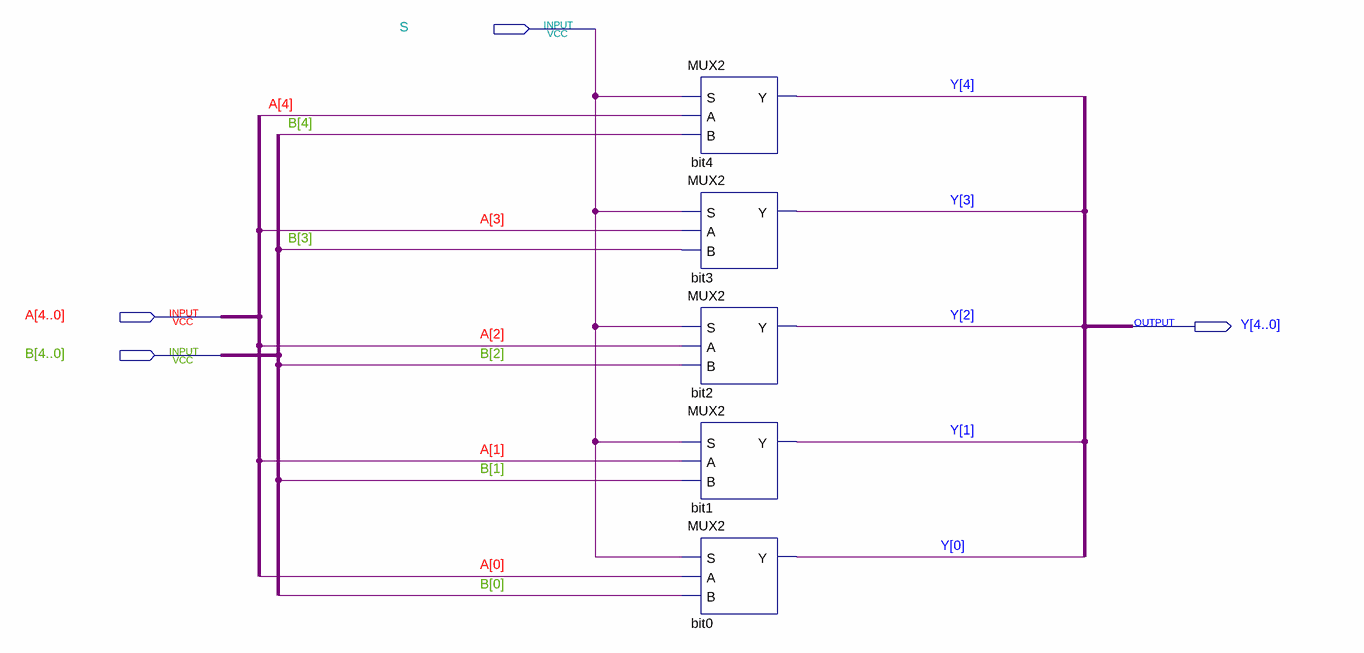
[diagram p0: schematic sheet]
// Quartus schematic MUX2_5.bdf as structural Verilog: 5 symbols, 4 pins
module MUX2_5 (
  input  S,
  input  [4:0] A,
  input  [4:0] B,
  output [4:0] Y
);

  MUX2 bit4 (.S(S), .A(A[4]), .B(B[4]), .Y(Y[4]));
  MUX2 bit3 (.S(S), .A(A[3]), .B(B[3]), .Y(Y[3]));
  MUX2 bit2 (.S(S), .A(A[2]), .B(B[2]), .Y(Y[2]));
  MUX2 bit1 (.S(S), .A(A[1]), .B(B[1]), .Y(Y[1]));
  MUX2 bit0 (.S(S), .A(A[0]), .B(B[0]), .Y(Y[0]));
endmodule
